# Altium schematic sheet LVDS_BackLight.SchDoc
size A4
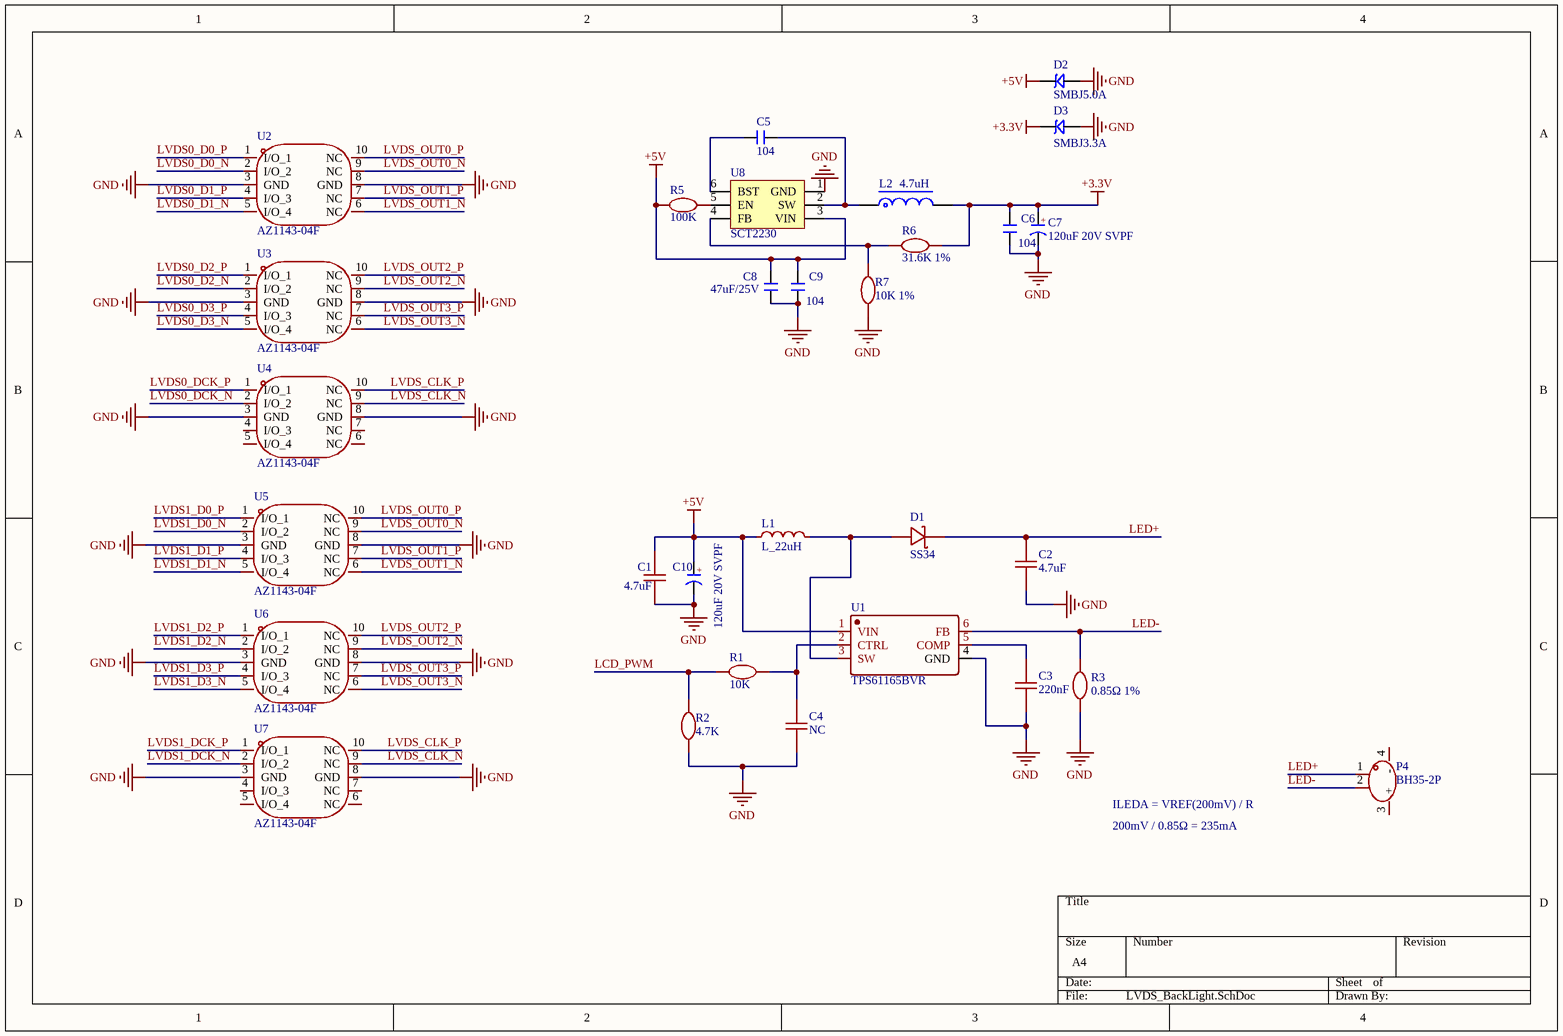
[diagram p0: LVDS_BackLight.SchDoc]

## Parts
C1  4.7uF  [C0805]
C2  4.7uF  [C0805]
C3  220nF  [C0805]
C4  NC  [C0805]
C5  104  [C 0603]
C6  104  [C 0603]
C7  120uF 20V SVPF  [CM D(6.3*7.7)]
C8  47uF/25V  [C 1206]
C9  104  [C 0603]
C10  120uF 20V SVPF  [CM D(6.3*7.7)]
D1  SS34  [SS34_1]
D2  SMBJ5.0A  [SMBJ]
D3  SMBJ3.3A  [SMBJ]
L1  L_22uH  [L_22uH]
L2  4.7uH  [L-SMD-0420]
P4  BH35-2P  [BH35-2P]
R1  10K  [C0805]
R2  4.7K  [C0805]
R3  0.85Ω 1%  [C0805]
R5  100K  [C0805]
R6  31.6K 1%  [C0805]
R7  10K 1%  [C0805]
U1  TPS61165BVR  [TPS61165BVT]
U2  AZ1143-04F  [AZ1143-04F]
U3  AZ1143-04F  [AZ1143-04F]
U4  AZ1143-04F  [AZ1143-04F]
U5  AZ1143-04F  [AZ1143-04F]
U6  AZ1143-04F  [AZ1143-04F]
U7  AZ1143-04F  [AZ1143-04F]
U8  SCT2230  [SOT23-6N]

## Nets
+3.3V: C6.2 C7.1(A) D3.2 L2.2 R6.1
+5V: C1.2 C8.2 C9.2 C10.1(A) D2.2 L1.1 R5.2 U1.1(VIN) U8.3(VIN)
GND: C1.1 C2.1 C3.1 C4.1 C6.1 C7.2(K) C8.1 C9.1 C10.2(K) D2.1 D3.1 R2.1 R3.1 R7.2 U1.4(GND) U2.3(GND) U2.8(GND) U3.3(GND) U3.8(GND) U4.3(GND) U4.8(GND) U5.3(GND) U5.8(GND) U6.3(GND) U6.8(GND) U7.3(GND) U7.8(GND) U8.1(GND)
LCD_PWM: R1.2 R2.2
LED+: C2.2 D1.1(C) P4.1
LED-: P4.2 R3.2 U1.6(FB)
LVDS0_D0_N: U2.2(I/O_2)
LVDS0_D0_P: U2.1(I/O_1)
LVDS0_D1_N: U2.5(I/O_4)
LVDS0_D1_P: U2.4(I/O_3)
LVDS0_D2_N: U3.2(I/O_2)
LVDS0_D2_P: U3.1(I/O_1)
LVDS0_D3_N: U3.5(I/O_4)
LVDS0_D3_P: U3.4(I/O_3)
LVDS0_DCK_N: U4.2(I/O_2)
LVDS0_DCK_P: U4.1(I/O_1)
LVDS1_D0_N: U5.2(I/O_2)
LVDS1_D0_P: U5.1(I/O_1)
LVDS1_D1_N: U5.5(I/O_4)
LVDS1_D1_P: U5.4(I/O_3)
LVDS1_D2_N: U6.2(I/O_2)
LVDS1_D2_P: U6.1(I/O_1)
LVDS1_D3_N: U6.5(I/O_4)
LVDS1_D3_P: U6.4(I/O_3)
LVDS1_DCK_N: U7.2(I/O_2)
LVDS1_DCK_P: U7.1(I/O_1)
LVDS_CLK_N: U4.9(NC) U7.9(NC)
LVDS_CLK_P: U4.10(NC) U7.10(NC)
LVDS_OUT0_N: U2.9(NC) U5.9(NC)
LVDS_OUT0_P: U2.10(NC) U5.10(NC)
LVDS_OUT1_N: U2.6(NC) U5.6(NC)
LVDS_OUT1_P: U2.7(NC) U5.7(NC)
LVDS_OUT2_N: U3.9(NC) U6.9(NC)
LVDS_OUT2_P: U3.10(NC) U6.10(NC)
LVDS_OUT3_N: U3.6(NC) U6.6(NC)
LVDS_OUT3_P: U3.7(NC) U6.7(NC)
NetC3_2: C3.2 U1.5(COMP)
NetC4_2: C4.2 R1.1 U1.2(CTRL)
NetC5_1: C5.1 U8.6(BST)
NetC5_2: C5.2 L2.1 U8.2(SW)
NetD1_2: D1.2(A) L1.2 U1.3(SW)
NetR5_1: R5.1 U8.5(EN)
NetR6_2: R6.2 R7.1 U8.4(FB)

Not connected (* = marked no-connect by the designer): P4 3(+) 4(-); U4 4(I/O_3) 5(I/O_4) 6(NC) 7(NC); U7 4(I/O_3) 5(I/O_4) 6(NC) 7(NC)

## Notes on the sheet
- ILEDA = VREF(200mV) / R
- 200mV / 0.85Ω = 235mA
- (in symbol C-CM) +

## Library data of the parts
C1-C4 = C
C5 C6 C9 = C: 无极性贴片电容; 版权归属: 源创客; BOM名称: 无极性贴片电容; 学习资源: www.ooocke.com
C7 C10 = C-CM: 贴片电解电容; 版权归属: 源创客; BOM名称: 贴片电解电容; 学习资源: www.ooocke.com
C8 = C_1: 无极性贴片电容; 版权归属: 源创客; BOM名称: 无极性贴片电容; 学习资源: www.ooocke.com
D1 = SS34: 肖特基二极管
D2 = SMBJ: TVS
D3 = SMBJ_1: TVS
L2 = L-CDRH: 功率屏蔽电感; 版权归属: 源创客; BOM名称: 功率屏蔽电感; 学习资源: www.ooocke.com
P4 = BH35-2P: 背光插头
R1-R3 R5-R7 = R
U1 = TPS61165BVR: TI背光芯片
U2-U7 = AZ1143-04F: ESD 保护阵列
U8 = DC JW5060T_6: DC降压芯片